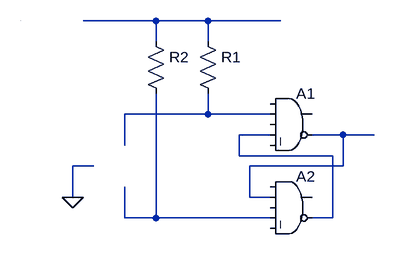
[diagram p0: schematic input.asc]
input.asc, the LTspice schematic file:
Version 4
SHEET 1 880 680
WIRE 208 0 96 0
WIRE 288 0 208 0
WIRE 400 0 288 0
WIRE 208 32 208 0
WIRE 288 32 288 0
WIRE 288 144 288 112
WIRE 288 144 160 144
WIRE 384 144 288 144
WIRE 384 176 336 176
WIRE 496 176 448 176
WIRE 544 176 496 176
WIRE 160 192 160 144
WIRE 336 208 336 176
WIRE 480 208 336 208
WIRE 112 224 80 224
WIRE 496 224 496 176
WIRE 496 224 352 224
WIRE 80 272 80 224
WIRE 352 272 352 224
WIRE 384 272 352 272
WIRE 160 304 160 256
WIRE 208 304 208 112
WIRE 208 304 160 304
WIRE 384 304 208 304
WIRE 480 304 480 208
WIRE 480 304 448 304
WIRE 0 0 0 0
FLAG 80 272 0
SYMBOL Digital\\and 416 96 R0
SYMATTR InstName A1
SYMBOL Digital\\and 416 224 R0
SYMATTR InstName A2
SYMBOL res 272 16 R0
SYMATTR InstName R1
SYMATTR Value ""
SYMBOL res 192 16 R0
SYMATTR InstName R2
SYMATTR Value ""

The netlist it stands for:
* input.asc
A1 0 N002 0 N003 0 N004 0 0 AND
A2 0 N004 0 N005 0 N003 0 0 AND
R1 N001 N002
R2 N001 N005
.backanno
.end